# Altium schematic sheet Power Suply.SchDoc
size A4; SheetNumber: 4; SheetTotal: 4
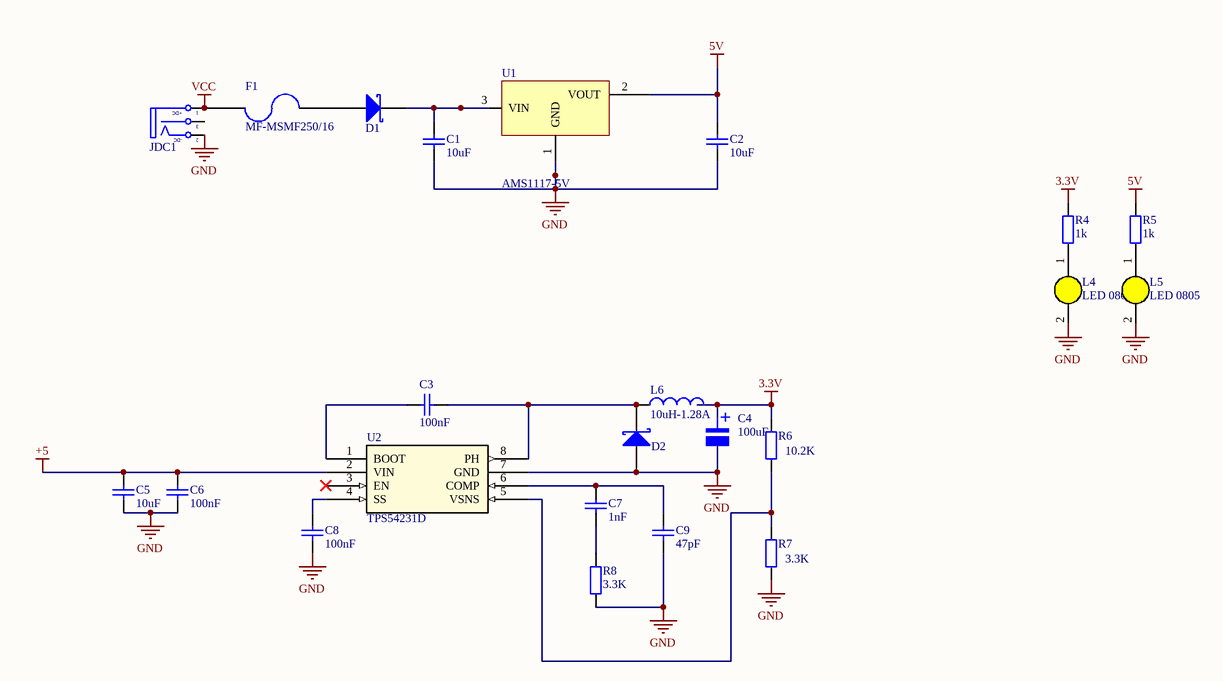
[diagram p0: Power Suply.SchDoc]

## Parts
C1  10uF  [tu 0805]
C2  10uF  [tu 0805]
C3  100nF  [tu 0805]
C4  100uF  [tu nhom 6.3 (d)]
C5  10uF  [tu 0805]
C6  100nF  [tu 0805]
C7  1nF  [tu 0805]
C8  100nF  [tu 0805]
C9  47pF  [tu 0805]
D1  D Schottky  [SS34]  (value not drawn)
D2  D Schottky  [SS34]  (value not drawn)
F1  MF-MSMF250/16  [MF-MSMF250/16]
JDC1  Jack DC  [DC-IN]  (value not drawn)
L4  LED 0805  [LED-0805-Yellow]
L5  LED 0805  [LED-0805-Yellow]
L6  value 10uH-1.28A  [I0805]  (hidden comment: Inductor)
R4  1k  [tro smd 0805]
R5  1k  [tro smd 0805]
R6  10.2K  [tro smd 0805]
R7  3.3K  [tro smd 0805]
R8  3.3K  [tro smd 0805]
U1  AMS1117-5V  [SOT230P700X180-4N]
U2  TPS54231D  [SOIC8_50_328_25X90_SMT]

## Nets
3.3V: C4.1 L6.2 R4.2 R6.2
5V: C2.1 R5.2 U1.2(VOUT)
+5: C5.2 C6.2 U2.2(VIN)
GND: C1.2 C2.2 C4.2 C5.1 C6.1 C8.1 C9.1 D2.1(A) JDC1.2(TN) L4.2(K) L5.2(K) R7.1 R8.1 U1.1(GND) U2.7(GND)
VCC: F1.1 JDC1.1(T)
NetC1_1: C1.1 D1.2(K) U1.3(VIN)
NetC3_1: C3.1 U2.1(BOOT)
NetC3_2: C3.2 D2.2(K) L6.1 U2.8(PH)
NetC7_1: C7.1 R8.2
NetC7_2: C7.2 C9.2 U2.6(COMP)
NetC8_2: C8.2 U2.4(SS)
NetD1_1: D1.1(A) F1.2
NetL4_1: L4.1(A) R4.1
NetL5_1: L5.1(A) R5.1
NetR6_1: R6.1 R7.2 U2.5(VSNS)

Not connected (* = marked no-connect by the designer): JDC1 3(S); U2 3(EN)*

## Notes on the sheet
- (in symbol Jack DC) +DC; -DC
- (in symbol Tu Nhom 100uF 16V) +

## Library data of the parts
C1 C2 = Tu 0805 101 50V 20%: Dán; Don_Vi: Con; So_Chan: 2; Ten_Linh_Kien: Tụ 0805 101-0.1nF 50V 20%; Ma_Hang: MH002806; Chung_Loai: Dán; Kieu_Chan: *
C3 C5-C9 = Tu 0805 106 16V 10%: Dán; Ten_Linh_Kien: Tụ 0805 106-10uF 10% 16V; So_Chan: 2; Don_Vi: Con; Ma_Hang: MH004553; Chung_Loai: Dán; Kieu_Chan: *
C4 = Tu Nhom 100uF 16V: Dán; Don_Vi: Con; So_Chan: 2; Ten_Linh_Kien: Tụ Nhôm 100uF 16V 6.3x5.4MM; Ma_Hang: MH002219; Chung_Loai: Dán; Kieu_Chan: *
D1 D2 = D Schottky: Schottky Diode; Published: 8-Jun-2000; LatestRevisionDate: 17-Jul-2002; LatestRevisionNote: Re-released for DXP Platform.; PackageReference: SMB; Publisher: Altium Limited; PackageDescription: DO-214-AA/SMB; 2 C-Bend Leads; Body 5.3 x 3.6 mm, inc. leads (LxW); Code_JEDEC: DO-214-AA
JDC1 = Jack DC: Jack DC input; Value: Jac DC
L4 L5 = LED 0805 Vang: Dán; Don_Vi: Con; Ma_Hang: MH002329; Ten_Linh_Kien: LED 0805 Màu Vàng ( Yellow); Ghi_Chu: *; Kieu_Chan: *; Chung_Loai: Dán
R4 R5 = Tro 0805 1% 1k: Dán; Don_Vi: Con; So_Chan: 2; Ten_Linh_Kien: Trở 0805 1% 1k; Ma_Hang: MH005468; Chung_Loai: Dán; Kieu_Chan: *
R6-R8 = Tro 0805 1% 5.1k: Dán; Don_Vi: Con; So_Chan: 2; Ten_Linh_Kien: Trở 0805 1% 5.1k; Ma_Hang: MH008812; Chung_Loai: Dán; Kieu_Chan: *
U2 = IC_TPS54360DDAR: Buck, Split Rail Switching Regulator IC Positive Adjustable 0.8V 1 Output 3.5A 8-PowerSOIC (0.154", 3.90mm Width); Manufacturer: Texas Instruments; Alternate Part Number-1: NA; Manufacturer Part Number: TPS54360DDAR; Case/Package: SOIC8; Supplier-1: LCSC; Supplier Part Number-1: C44377